# Altium project SatController.PrjPcb
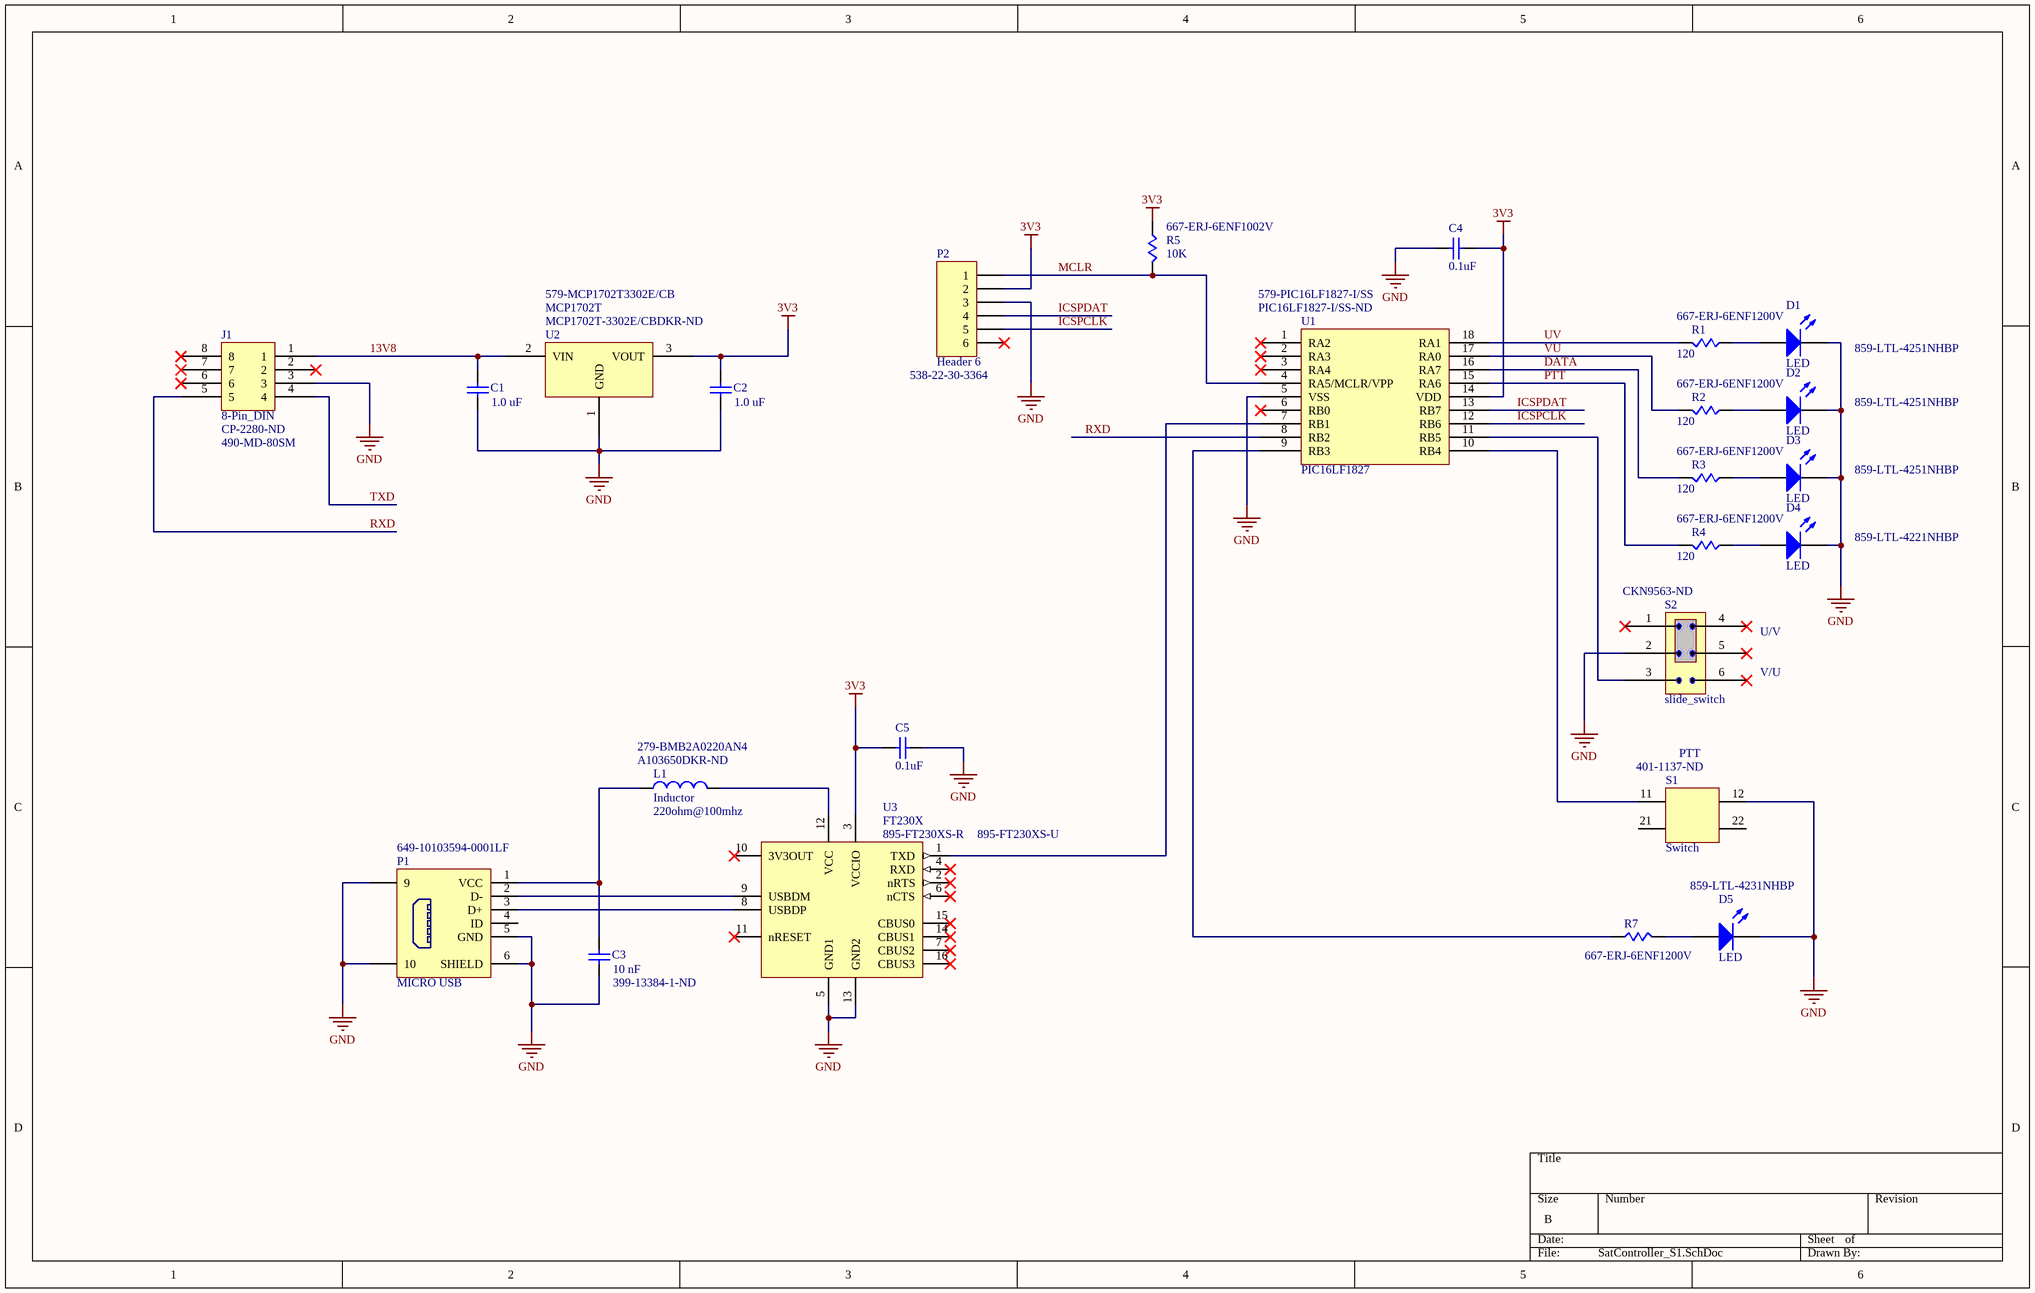
[diagram p0: SatController_S1.SchDoc]
1 sheet, 25 parts. Net scope: global (net labels, ports and power ports of the same name join across sheets).
Board file: SatController.PcbDoc

## Sheet SatController_S1.SchDoc
size B

### Parts
C1  1.0 uF  [CAPC2012L]
C2  Vaule: 1.0 uF  [CAPC2012L]
C3  Supplier Part Number 1: 399-13384-1-ND  [CAPC1608L]  (hidden comment: 10 nF)
C4  0.1uF  [CAPC2012L]
C5  0.1uF  [CAPC2012L]
D1  LED  Supplier Part Number 1: 859-LTL-4251NHBP  [LTL-4231HNBP]
D2  LED  Supplier Part Number 1: 859-LTL-4251NHBP  [LTL-4231HNBP]
D3  LED  Supplier Part Number 1: 859-LTL-4251NHBP  [LTL-4231HNBP]
D4  LED  Supplier Part Number 1: 859-LTL-4221NHBP  [LTL-4231HNBP]
D5  LED  Supplier Part Number 1: 859-LTL-4231NHBP  [LTL-4231HNBP]
J1  8-Pin_DIN  Supplier Part Number 1: CP-2280-ND  Supplier Part Number 2: 490-MD-80SM  [MD-80SM]
L1  Inductor  value 220ohm@100mhz  Supplier Part Number 1: A103650DKR-ND  Supplier Part Number 2: 279-BMB2A0220AN4  [6-0805_N]
P1  Supplier Part Number 1: 649-10103594-0001LF  [Connector, Micro-USB, 5-pin - prototype]  (hidden comment: Micro USB)
P2  Header 6  Supplier Part Number 1: 538-22-30-3364  [HDR1X6]
R1  Supplier Part Number 1: 667-ERJ-6ENF1200V  Vaule: 120  [RESC2012L]
R2  Supplier Part Number 1: 667-ERJ-6ENF1200V  Vaule: 120  [RESC2012L]
R3  Supplier Part Number 1: 667-ERJ-6ENF1200V  Vaule: 120  [RESC2012L]
R4  Supplier Part Number 1: 667-ERJ-6ENF1200V  Vaule: 120  [RESC2012L]
R5  Vaule: 10K  Supplier Part Number 1: 667-ERJ-6ENF1002V  [RESC2012L]
R7  Supplier Part Number 1: 667-ERJ-6ENF1200V  [RESC2012L]
S1  Vaule: Switch  Supplier Part Number 1: 401-1137-ND  [PVA1_Switch]  (hidden comment: PVA-KeySwitch)
S2  slide_switch  Supplier Part Number 1: CKN9563-ND  [OS202011MA0QN1]
U1  PIC16LF1827  Supplier Part Number 2: PIC16LF1827-I/SS-ND  Supplier Part Number 3: 579-PIC16LF1827-I/SS  [SOIC127P1030-18M]
U2  MCP1702T  Supplier Part Number 1: MCP1702T-3302E/CBDKR-ND  Supplier Part Number 2: 579-MCP1702T3302E/CB  [SOT23-3N]
U3  FT230X  Supplier Part Number 1: 895-FT230XS-R  Supplier Part Number 2: 895-FT230XS-U  [SOP64P600X175-16N]

### Nets
3V3: C2.2 C4.1 C5.2 P2.2 R5.1 U1.14(VDD) U2.3(VOUT) U3.3(VCCIO)
GND: C1.1 C2.1 C3.1 C4.2 C5.1 D1.2(K) D2.2(K) D3.2(K) D4.2(K) D5.2(K) J1.3 P1.5(GND) P1.6(SHIELD) P1.9 P1.10 P2.3 S1.12 S2.2 U1.5(VSS) U2.1(GND) U3.5(GND1) U3.13(GND2)
13V8: C1.2 J1.1 U2.2(VIN)
DATA: R3.2 U1.16(RA7)
ICSPCLK: P2.5 U1.12(RB6)
ICSPDAT: P2.4 U1.13(RB7)
MCLR: P2.1 R5.2 U1.4(RA5/MCLR/VPP)
PTT: R4.2 U1.15(RA6)
RXD: J1.5 U1.8(RB2)
TXD: J1.4
UV: R1.2 U1.18(RA1)
VU: R2.2 U1.17(RA0)
NetC3_2: C3.2 L1.1 P1.1(VCC)
NetD1_1: D1.1(A) R1.1
NetD2_1: D2.1(A) R2.1
NetD3_1: D3.1(A) R3.1
NetD4_1: D4.1(A) R4.1
NetD5_1: D5.1(A) R7.2
NetL1_2: L1.2 U3.12(VCC)
NetP1_2: P1.2(D-) U3.9(USBDM)
NetP1_3: P1.3(D+) U3.8(USBDP)
NetR7_1: R7.1 U1.9(RB3)
NetS1_11: S1.11 U1.10(RB4)
NetS2_3: S2.3 U1.11(RB5)
NetU1_7: U1.7(RB1) U3.1(TXD)

Not connected (* = marked no-connect by the designer): J1 2* 6* 7* 8*; P1 4(ID); P2 6*; S1 21 22; S2 1* 4* 5* 6*; U1 1(RA2)* 2(RA3)* 3(RA4)* 6(RB0)*; U3 2(nRTS)* 4(RXD)* 6(nCTS)* 7(CBUS2)* 10(3V3OUT)* 11(nRESET)* 14(CBUS1)* 15(CBUS0)* 16(CBUS3)*

### Notes on the sheet
- U/V
- V/U
- (near S1) PTT

### Library data of the parts
C1 C2 C4 C5 = Cap Semi
  C1: Value: 1.0 uF
  C4 C5: Value: 0.1uF
C3 = Cap Semi: CAP CER 1UF 6.3V 10% X5R 0603; Manufacturer Part Number 1: C1608X5R0J105K; Manufacturer 1: TDK; Manufacturer: Kemet; Manufacturer Part Number: C0603C103J5JAC7867; Capacitance: 10000pF; Tolerance: ±5%; Voltage - Rated: 50V; Temperature Coefficient: U2J; Published: 8-Jun-2000; LatestRevisionDate: 29-May-2009; LatestRevisionNote: IPC-7351 Footprint Added.; PackageReference: C1206; Publisher: Altium Limited; PackageDescription: Chip Capacitor; Value: 10 nF; Supplier 1: Digi-Key; RoHS: RoHS Compliant; Category: Capacitors; Stock 1: 3218; Pricing 1: 1=0.29, 10=0.195, 50=0.118, 100=0.0991, 250=0.08024, 500=0.0708, 1000=0.06018 (USD); Packaging: Cut Tape (CT); Mounting Type: Surface Mount, MLCC; Operating Temperature: -55°C ~ 125°C; Applications: General Purpose; Ratings: -; Package / Case: 0603 (1608 Metric); Size / Dimension: 0.063" L x 0.032" W (1.60mm x 0.80mm); Height - Seated (Max): -; Thickness (Max): 0.034" (0.87mm); Lead Spacing: -; Features: -; Lead Style: -; ComponentLink1URL: http://www.kemet.com/Lists/ProductCatalog/Attachments/642/KEM_C1086_U2J.pdf; ComponentLink1Description: http://www.kemet.com/Lists/ProductCatalog/Attachments/642/KEM_C1086_U2J.pdf
D1-D3 = LED3mm-ra: SMD LED; Manufacturer: Lite-On; Manufacturer Part Number: LTL-4251NHBP; Configuration: 1 Single Color LED, Single Level; Illumination Color: Yellow; Lens Color/Style: Diffused; Number of LEDs: 1; Wavelength: 588 nm; LED Size: 3 mm; Lens Shape: Dome; Luminous Intensity: 5.6 mcd; Viewing Angle: 60 deg; If - Forward Current: 10 mA; Vf - Forward Voltage: 2.1 V; Supplier 1: Mouser; RoHS: RoHS Compliant; Category: LED Circuit Board Indicators; Stock 1: 1358; Pricing 1: 1=0.200, 10=0.184, 50=0.160, 100=0.141, 500=0.125, 1000=0.113, 2000=0.104, 5000=0.090, 10000=0.082 (USD); Height: 7.3 mm; Mounting Type: Through Hole; Orientation: Right Angle; Packaging: Bulk; Width: 4.6 mm; Brand: Lite-On; Standard Pack Qty: 180; RoHS - Mouser: Y; Minimum Order Quantity: 1; Reeling: False; ComponentLink1URL: http://www.mouser.com/ds/2/239/S_110_LTL-4251NHBP-346926.pdf; ComponentLink1Description: http://www.mouser.com/ds/2/239/S_110_LTL-4251NHBP-346926.pdf
D4 = LED3mm-ra: SMD LED; Manufacturer: Lite-On; Manufacturer Part Number: LTL-4221NHBP; Configuration: 1 Single Color LED, Single Level; Illumination Color: Red; Lens Color/Style: Diffused; Number of LEDs: 1; Wavelength: 623 nm; LED Size: 3 mm; Lens Shape: Dome; Luminous Intensity: 8.7 mcd; Viewing Angle: 60 deg; If - Forward Current: 10 mA; Vf - Forward Voltage: 2 V; Supplier 1: Mouser; RoHS: RoHS Compliant; Category: LED Circuit Board Indicators; Stock 1: 446; Pricing 1: 1=0.200, 10=0.179, 50=0.154, 100=0.136, 500=0.122, 1000=0.109, 2000=0.100, 5000=0.087, 10000=0.079 (USD); Height: 7.3 mm; Mounting Type: Through Hole; Orientation: Right Angle; Packaging: Tray; Width: 4.6 mm; Brand: Lite-On; Standard Pack Qty: 180; RoHS - Mouser: Y; Minimum Order Quantity: 1; Reeling: False; ComponentLink1URL: http://www.mouser.com/ds/2/239/liteon_ltl-4221nhbp-347055.pdf; ComponentLink1Description: http://www.mouser.com/ds/2/239/liteon_ltl-4221nhbp-347055.pdf
D5 = LED3mm-ra: SMD LED; Manufacturer: Lite-On; Manufacturer Part Number: LTL-4231NHBP; Configuration: 1 Single Color LED, Single Level; Illumination Color: Green; Lens Color/Style: Green Diffused; Number of LEDs: 1; Wavelength: 569 nm; LED Size: 3 mm; Lens Shape: Dome; Luminous Intensity: 12.6 mcd; Viewing Angle: 60 deg; If - Forward Current: 10 mA; Vf - Forward Voltage: 2.1 V; Supplier 1: Mouser; RoHS: RoHS Compliant; Category: LED Circuit Board Indicators; Stock 1: 695; Pricing 1: 1=0.200, 10=0.172, 50=0.149, 100=0.131, 500=0.117, 1000=0.106, 2000=0.097, 5000=0.085, 10000=0.077 (USD); Height: 7.3 mm; Mounting Type: Through Hole; Orientation: Right Angle; Packaging: Tray; Width: 4.6 mm; Brand: Lite-On; Standard Pack Qty: 420; RoHS - Mouser: Y; Minimum Order Quantity: 1; Reeling: False; ComponentLink1URL: http://www.mouser.com/ds/2/239/S_110_LTL-4231NHBP-336244.pdf; ComponentLink1Description: http://www.mouser.com/ds/2/239/S_110_LTL-4231NHBP-336244.pdf
J1 = 8-Pin_DIN: Manufacturer: CUI; Current Rating: 1 A, 2 A; Gender: Female; Number of Positions: 8 Position; Voltage Rating: 100 VAC, 12 VDC; Supplier 1: Digi-Key; Supplier 2: Mouser; Manufacturer Part Number: MD-80SM; RoHS: RoHS Compliant; Category: DIN Connectors; Stock 2: 2923; Pricing 2: 1=1.64, 10=1.36, 25=1.21, 100=1.01, 250=0.911, 500=0.810, 1000=0.734, 2500=0.658, 5000=0.645 (USD); Contact Plating: Silver; Orientation: Right Angle; Termination Style: Through Hole; Brand: CUI; Contact Material: Phosphor Bronze; Mounting Style: Through Hole; Standard: Mini-DIN; Standard Pack Qty: 500; RoHS - Mouser: Y; Minimum Order Quantity: 1; Reeling: False; ComponentLink1URL: http://www.mouser.com/ds/2/670/md-xxsm-series-516000.pdf; ComponentLink1Description: http://www.mouser.com/ds/2/670/md-xxsm-series-516000.pdf
L1 = Inductor: Manufacturer: TE Connectivity / Sigma Inductors; Manufacturer Part Number: BMB2A0220AN4; Impedance: 220 Ohms; Maximum DC Current: 250 mA; Maximum DC Resistance: 500 mOhms; Tolerance: 25 %; Type: Multilayer Chip Bead; Test Frequency: 100 MHz; Published: 8-Jun-2000; LatestRevisionDate: 29-May-2009; LatestRevisionNote: IPC-7351 Footprint Added.; PackageReference: 0402-A; Publisher: Altium Limited; PackageDescription: Chip Inductor; Supplier 1: Digi-Key; Supplier 2: Mouser; RoHS: RoHS Compliant; Category: EMI Filter Beads, Chips & Arrays; Stock 2: 15257; Pricing 2: 1=0.100, 25=0.076, 50=0.057, 100=0.038, 250=0.033, 500=0.029 (USD); Capacitance: -; Height: 0.9 mm; Length: 2 mm; Operating Temperature Range: - 55 C to + 125 C; Package / Case: 0805 (2012 metric); Packaging: Reel; Product: Ferrite Chip Beads; Series: BMB; Termination Style: SMD/SMT; Width: 1.25 mm; Brand: TE Connectivity / Sigma Inductors; Standard Pack Qty: 4000; RoHS - Mouser: Y; Minimum Order Quantity: 1; Reeling: True; ComponentLink1URL: http://www.mouser.com/ds/2/418/NG_CD_1624117_BA1-686778.pdf; ComponentLink1Description: http://www.mouser.com/ds/2/418/NG_CD_1624117_BA1-686778.pdf
P1 = Micro USB: Manufacturer: Amphenol FCI; Manufacturer Part Number: 10103594-0001LF; Connector Type: Micro USB Type B Receptacle; Current Rating: 1.8 A; Number of Contacts: 5 Contact; Number of Ports: 1 Port; Insulation Resistance: 1000 MOhms; Manufacturer 1: *; Manufacturer Part Number 1: *; Value: MICRO USB; Supplier 1: Mouser; RoHS: RoHS Compliant; Category: USB Connectors; Stock 1: 6809; Pricing 1: 1=0.660, 10=0.621, 100=0.476, 500=0.414, 1500=0.342, 3000=0.311, 6000=0.300, 9000=0.280, 24000=0.275 (USD); Contact Plating: Gold; Packaging: Reel; Product: Micro USB Type B Connectors; Termination Style: Solder; Brand: Amphenol FCI; Contact Material: Copper Alloy; Standard Pack Qty: 1500; RoHS - Mouser: Y; Minimum Order Quantity: 1; Reeling: True; ComponentLink1URL: http://www.mouser.com/ds/2/18/10103594-941365.pdf; ComponentLink1Description: http://www.mouser.com/ds/2/18/10103594-941365.pdf
P2 = Header 6: Header, 6-Pin; Manufacturer: Molex; Mounting Angle: Straight; Number of Positions: 36 Position; Pitch: 2.54 mm; Mating Post Length: 8.13 mm; LatestRevisionDate: 17-Jul-2002; LatestRevisionNote: Re-released for DXP Platform.; Publisher: Altium Limited; Supplier 1: Mouser; Manufacturer Part Number: 22-30-3364; RoHS: RoHS Compliant; Category: Headers & Wire Housings; Stock 1: 1925; Pricing 1: 1=1.41, 10=1.26, 25=1.20, 100=1.09, 250=1.00, 500=0.864, 1000=0.806, 2500=0.767, 5000=0.748 (USD); Accessory Type: -; Contact Plating: Tin; Contact Type: -; Housing Material: Nylon; Number of Rows: 1 Row; Packaging: Bulk; Product: Headers; Series: 42375; Termination Style: Through Hole; Type: Breakaway; Brand: Molex; Mounting Style: Straight Pin; Row Spacing: -; Contact Gender: Pin (Male); Standard Pack Qty: 250; Termination Post Length: 3.05 mm; Tradename: KK; RoHS - Mouser: Y; Minimum Order Quantity: 1; Reeling: False; ComponentLink1URL: http://www.mouser.com/ds/2/276/022303364_sd-589297.pdf; ComponentLink1Description: http://www.mouser.com/ds/2/276/022303364_sd-589297.pdf
R1-R4 R7 = R: RES 120 OHM 1/10W 1% 0402 SMD; Manufacturer: Panasonic; Manufacturer Part Number: ERJ-6ENF1200V; Power Rating: 125 mW (1/8 W); Resistance: 120 Ohms; Temperature Coefficient: 100 PPM / C; Voltage Rating: 150 V; Qualification: AEC-Q200; Supplier 1: Mouser; RoHS: RoHS Compliant By Exemption; Category: Thick Film Resistors - SMD; Stock 1: 66290; Pricing 1: 1=0.300, 10=0.028, 100=0.012, 1000=0.008, 5000=0.005, 10000=0.004, 25000=0.003 (USD); Height: 0.6 mm; Length: 2 mm; Operating Temperature Range: - 55 C to + 155 C; Package / Case: 0805 (2012 metric); Packaging: Reel; Product: Thick Film Resistors SMD; Series: ERJ; Termination Style: SMD/SMT; Tolerance: 1 %; Type: Precision Thick Film Resistors SMD; Width: 1.2 mm; Brand: Panasonic; Case Code - in: 0805; Case Code - mm: 2012; Standard Pack Qty: 5000; RoHS - Mouser: E; Minimum Order Quantity: 1; Reeling: True; ComponentLink1URL: http://www.mouser.com/ds/2/315/AOA0000C86-911473.pdf; ComponentLink1Description: http://www.mouser.com/ds/2/315/AOA0000C86-911473.pdf
R5 = R: RES 120 OHM 1/10W 1% 0402 SMD; Manufacturer: Panasonic; Manufacturer Part Number: ERJ-6ENF1002V; Power Rating: 125 mW (1/8 W); Resistance: 10 kOhms; Temperature Coefficient: 100 PPM / C; Voltage Rating: 150 V; Qualification: AEC-Q200; Supplier 1: Mouser; RoHS: RoHS Compliant By Exemption; Category: Thick Film Resistors - SMD; Stock 1: 112590; Pricing 1: 1=0.300, 10=0.028, 100=0.012, 1000=0.008, 5000=0.005, 10000=0.004, 25000=0.003 (USD); Features: High reliability, Small Size and Light Weight; Height: 0.6 mm; Length: 2 mm; Operating Temperature Range: - 55 C to + 155 C; Package / Case: 0805 (2012 metric); Packaging: Reel; Product: Thick Film Resistors SMD; Series: ERJ; Termination Style: SMD/SMT; Tolerance: 1 %; Type: Precision Thick Film Resistors SMD; Width: 1.2 mm; Brand: Panasonic; Case Code - in: 0805; Case Code - mm: 2012; Standard Pack Qty: 5000; RoHS - Mouser: E; Minimum Order Quantity: 1; Reeling: True; ComponentLink1URL: http://www.mouser.com/ds/2/315/AOA0000C86-911473.pdf; ComponentLink1Description: http://www.mouser.com/ds/2/315/AOA0000C86-911473.pdf
S1 = PVA-KeySwitch: Manufacturer: C&K Components; Manufacturer Part Number: PVA1 OA H3 1.2N V2; Description: SWITCH PUSH DPST-NO 0.1A 32V; Circuit: DPST-NO; Switch Function: Off-Mom; Current Rating: 100mA (DC); Voltage Rating - DC: 32V; Actuator Type: Plunger for Cap; Color - Actuator/Cap: White; Electrical Life: 100,000 Cycles; Supplier 1: Digi-Key; RoHS: RoHS Compliant; Category: Switches; Stock 1: 3030; Pricing 1: 1=1.23, 10=1.145, 25=1.09, 50=1.0356, 100=1.0083, 250=0.981, 500=0.9265, 1000=0.872, 5000=0.73575 (USD); Packaging: Bulk; Type: Keyswitch; Voltage Rating - AC: -; Illumination Type, Color: -; Illumination Voltage (Nominal): -; Mounting Type: Through Hole; Termination Style: PC Pin; Ingress Protection: -; Features: -; Panel Cutout Dimensions: -; Operating Temperature: -40°C ~ 85°C; Mechanical Life: -; ComponentLink1URL: http://www.ck-components.com/media/1343/pva.pdf; ComponentLink1Description: http://www.ck-components.com/media/1343/pva.pdf
S2 = slide_switch: Manufacturer: C&K Components; Description: SWITCH SLIDE DPDT 100MA 12V; Circuit: DPDT; Contact Timing: Non-Shorting (BBM); Switch Function: On-On; Current Rating: 100mA (DC); Voltage Rating - DC: 12V; Actuator Type: Standard; Actuator Length: 4.00mm; Actuator Material: Polyoxymethylene (Acetal) (POM); Switch Travel: 2.00mm; Mechanical Life: 10,000 Cycles; Supplier 1: Digi-Key; Manufacturer Part Number: OS202011MA0QN1; RoHS: RoHS Compliant; Category: Switches; Stock 1: 7087; Pricing 1: 1=0.52, 10=0.502, 25=0.4912, 50=0.439, 100=0.418, 250=0.40756, 500=0.34486, 1000=0.3344, 5000=0.2926 (USD); Packaging: Bulk; Voltage Rating - AC: -; Contact Material: Copper Alloy; Contact Finish: Silver; Mounting Type: Through Hole, Right Angle; Termination Style: PC Pin; Features: Epoxy Sealed Terminals; Operating Temperature: -30°C ~ 70°C; Electrical Life: 10,000 Cycles; Operating Force: -; ComponentLink1URL: http://www.ck-components.com/media/1428/os.pdf; ComponentLink1Description: http://www.ck-components.com/media/1428/os.pdf
U1 = PIC16LF1827: Manufacturer: Microchip Technology; Manufacturer Part Number: PIC16LF1827-I/SS; Core Processor: PIC; Core Size: 8-Bit; Speed: 32MHz; Connectivity: I²C, SPI, UART/USART; Peripherals: Brown-out Detect/Reset, POR, PWM, WDT; Number of I/O: 16; Program Memory Size: 7KB (4K x 14); Program Memory Type: FLASH; EEPROM Size: 256 x 8; RAM Size: 384 x 8; Voltage - Supply (Vcc/Vdd): 1.8 V ~ 3.6 V; Data Converters: A/D 12x10b; Oscillator Type: Internal; Data RAM Size: 384 B; Data RAM Type: SRAM; Interface Type: I2C, SPI, UART; Number of I/Os: 16 I/O; ADC Resolution: 10 bit; Data Bus Width: 8 bit; Maximum Clock Frequency: 32 kHz; Number of ADC Channels: 12; Number of Timers/Counters: 5 Timer; Operating Supply Voltage: 1.8 V to 3.6 V; Processor Series: PIC16; Supply Voltage - Max: 3.6 V; Supply Voltage - Min: 2.5 V; Supplier 1: Digi-Key; RoHS: RoHS Compliant; Category: Integrated Circuits (ICs); Stock 2: 1195; Pricing 2: 1=1.43, 25=1.31, 100=1.18 (USD); Packaging: Tube; Operating Temperature: -40°C ~ 85°C (TA); Package / Case: 20-SSOP (0.209", 5.30mm Width); Supplier Device Package: 20-SSOP; ComponentLink1URL: http://www.microchip.com/mymicrochip/filehandler.aspx?ddocname=en544642; ComponentLink1Description: http://www.microchip.com/mymicrochip/filehandler.aspx?ddocname=en544642; Supplier 3: Mouser; Stock 3: 300; Pricing 3: 1=1.72, 10=1.43, 25=1.31, 100=1.18 (USD); Height: 1.75 mm; Length: 7.2 mm; Product: MCU; Series: PIC16; Width: 5.3 mm; Brand: Microchip Technology; Mounting Style: SMD/SMT; Core: PIC; Maximum Operating Temperature: + 125 C; Minimum Operating Temperature: - 40 C; Standard Pack Qty: 67; RoHS - Mouser: Y; Minimum Order Quantity: 1; Reeling: False; ComponentLink2URL: http://www.mouser.com/ds/2/268/41391B-31089.pdf; ComponentLink2Description: http://www.mouser.com/ds/2/268/41391B-31089.pdf
U2 = MCP1702T: Manufacturer: Microchip Technology; Manufacturer Part Number: MCP1702T-3302E/CB; Input Voltage MAX: 13.2 V; Number of Outputs: 1 Output; Output Current: 250 mA; Output Type: Fixed; Output Voltage: 3.3 V; Quiescent Current: 5 uA; Dropout Voltage - Max: 725 mV at 250 mA; Voltage Regulation Accuracy: 0.4 %; Dropout Voltage: 0.525 V at 250 mA; Ib - Input Bias Current: 2 uA; Input Voltage MIN: + 2.7 V; Line Regulation: 0.1 % / V; Load Regulation: 1 %; Polarity: Positive; Supplier 1: Digi-Key; Supplier 2: Mouser; RoHS: RoHS Compliant; Category: LDO Voltage Regulators; Stock 2: 17960; Pricing 2: 1=0.520, 10=0.480, 25=0.400, 100=0.360, 3000=0.360 (USD); Height: 1.3 mm (Max); Length: 3.1 mm (Max); Package / Case: SOT-23-3; Packaging: Reel; Width: 1.8 mm (Max); Brand: Microchip Technology; Mounting Style: SMD/SMT; Maximum Operating Temperature: + 125 C; Minimum Operating Temperature: - 40 C; Standard Pack Qty: 3000; RoHS - Mouser: Y; Minimum Order Quantity: 1; Reeling: True; ComponentLink1URL: http://www.mouser.com/ds/2/268/22008a-53656.pdf; ComponentLink1Description: http://www.mouser.com/ds/2/268/22008a-53656.pdf
U3 = FT230X: Manufacturer: FTDI; Manufacturer Part Number: FT230XS-U; Data Rate: 480 Mb/s; Speed: High-Speed; Interface Type: UART; Operating Supply Current: 8 mA; Operating Supply Voltage: 5 V; Supplier 1: Mouser; Supplier 2: Mouser; RoHS: RoHS Compliant; Category: USB Interface IC; Stock 2: 526; Pricing 2: 1=2.04, 25=1.97, 100=1.90, 250=1.71, 500=1.54, 1000=1.46, 2500=1.40 (USD); Package / Case: SSOP-16; Packaging: Tube; Product: USB Bridge Controllers; Series: FT230; Type: Bridge, USB to UART; Brand: FTDI; Mounting Style: SMD/SMT; Maximum Operating Temperature: + 85 C; Minimum Operating Temperature: - 40 C; Standard: USB 2.0; Standard Pack Qty: 100; Tradename: X-CHIP; RoHS - Mouser: Y; Minimum Order Quantity: 1; Reeling: False; ComponentLink1URL: http://www.mouser.com/ds/2/163/DS_FT230X-5395.pdf; ComponentLink1Description: http://www.mouser.com/ds/2/163/DS_FT230X-5395.pdf